# Altium schematic sheet reference_0v5_ADR130.SchDoc: 0.5 V Fixed reference voltage
size A4
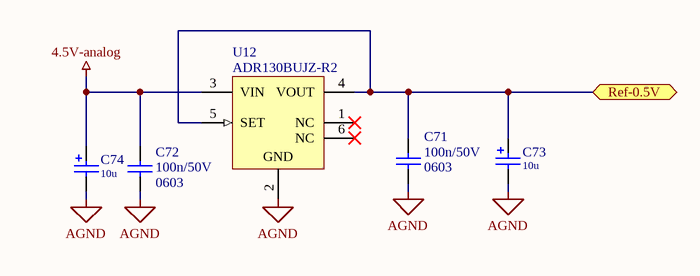
[diagram p0: reference_0v5_ADR130.SchDoc]

## Parts
C71  Package: 0603  [SMD_Capacitor_0603]  (hidden comment: 100n/50V)
C72  Package: 0603  [SMD_Capacitor_0603]  (hidden comment: 100n/50V)
C73  10u  [Tantalum_cap_B]
C74  10u  [Tantalum_cap_B]
U12  ADR130BUJZ-R2  [ADI-UJ-6_M]

## Ports
Ref-0.5V

## Nets
4.5V-analog: C72.1 C74.1 U12.3(VIN)
AGND: C71.2 C72.2 C73.2 C74.2 U12.2(GND)
Ref-0.5V: C71.1 C73.1 U12.4(VOUT) U12.5(SET) ; port Ref-0.5V

Not connected (* = marked no-connect by the designer): U12 1(NC)* 6(NC)*

## Notes on the sheet
- Title:
- Sheet:
- of
- Author:
- Model:
- Document Number:
- Checked by:
- Iss-Rev:
- Approved by:
- Date:
- File name:

## Library data of the parts
C71 C72 = Cer_C0603T104K5RALTU: Ceramic Cap Kemet COTS 100n/50V X7R 0603; Manufacturer: Kemet; ManufacturerPartNumber: C0603T104K5RALTU; Value: 100n/50V
C73 C74 = Cap Tantalum: Tantalum Capacitor; Value: 10u
U12 = ADR130BUJZ-R2: Precision Series Sub-Band Gap Voltage Reference, 1 V Output, 2 to 18 V Supply, Industrial, 6-pin SOT23 (UJ-6), Reel; Manufacturer: Analog Devices; Max V Supply (V): 18; Min V Supply (V): 2; Ref Out TC (ppm/C): 5; Vout: 0.5V, 1V; DatasheetVersion: Rev. B; PackageVersion: Dec-04; PackageReference: UJ-6; PackageDescription: 6-Pin Thin Small Outline Transistor Package, Body 2.9 x 1.6 mm, Pitch 0.95 mm; Supplier 1: Digi-Key; Supplier Part Number 1: ADR130BUJZ-R2TR-ND; Supplier 2: Digi-Key; Supplier Part Number 2: ADR130BUJZ-R2CT-ND; Supplier 3: Digi-Key; Supplier Part Number 3: ADR130BUJZ-R2DKR-ND; Supplier 4: Farnell; Supplier Part Number 4: 1699555; Supplier 5: Mouser; Supplier Part Number 5: 584-ADR130BUJZ-R2; Packing: Reel; Operating Temp Range: -40 to 125 degC; Mounting Technology: Surface Mount; Code_JEDEC: MO-193-AA; PartNumber: ADR130BUJZ-R2; ComponentLink1Description: Manufacturer URL; ComponentLink1URL: http://www.analog.com/en/index.html; ComponentLink2Description: Datasheet; ComponentLink2URL: http://www.analog.com/static/imported-files/data_sheets/ADR130.pdf; ComponentLink3Description: Package Specification; ComponentLink3URL: http://www.analog.com/static/imported-files/packages/PKG_PDF/TSOT(UJ)/UJ_6.pdf; ComponentLink4Description: URL Link1; ComponentLink4URL: Product URL:http://www.analog.com/en/special-linear-functions/voltage-references/adr130/products/product.html